# EAGLE design v001 (EAGLE 6.4)
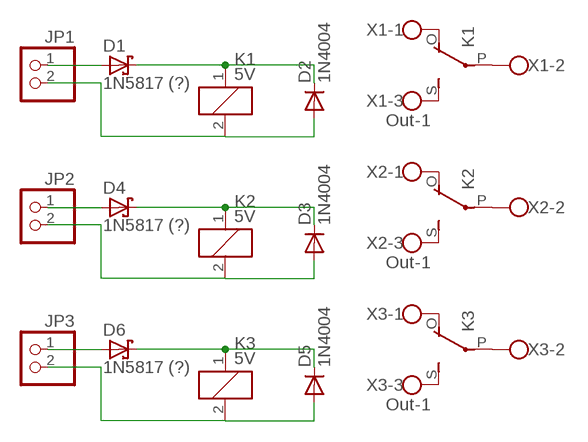
[diagram p0: schematic, sheet 1]

## Parts
D1  1N5817 (?)  1N5817-B  [DO41-7.6]
D2  1N4004  [DO41-10]
D3  1N4004  [DO41-10]
D4  1N5817 (?)  1N5817-B  [DO41-7.6]
D5  1N4004  [DO41-10]
D6  1N5817 (?)  1N5817-B  [DO41-7.6]
JP1  PINHD-1X2  [1X02]
JP2  PINHD-1X2  [1X02]
JP3  PINHD-1X2  [1X02]
K1  5V  G5L  [G5LE]
K2  5V  G5L  [G5LE]
K3  5V  G5L  [G5LE]
X1  Out-1  W237-103  [W237-103]
X2  Out-1  W237-103  [W237-103]
X3  Out-1  W237-103  [W237-103]

## Nets
N$1: K1.P(2:P) X1.2
N$2: K1.O(2:O) X1.1
N$3: K1.S(2:S) X1.3
N$4: D1.A JP1.1
N$5: D2.A JP1.2 K1.2
N$6: D1.C D2.C K1.1
N$7: K2.P(2:P) X2.2
N$8: K2.O(2:O) X2.1
N$9: K2.S(2:S) X2.3
N$10: D4.A JP2.1
N$11: D3.A JP2.2 K2.2
N$12: D3.C D4.C K2.1
N$13: K3.P(2:P) X3.2
N$14: K3.O(2:O) X3.1
N$15: K3.S(2:S) X3.3
N$16: D6.A JP3.1
N$17: D5.A JP3.2 K3.2
N$18: D5.C D6.C K3.1

## Library data of the parts
D1 D4 D6 = diode:1N581*: 1.0A SCHOTTKY BARRIER RECTIFIER Source: http://www.diodes.com/datasheets/ds23001.pdf
D2 D3 D5 = diode:1N4004: DIODE general purpose rectifier, 1 A
JP1-JP3 = pinhead:PINHD-1X2: PIN HEADER
K1-K3 = relay:G5L: RELAY 1 x switch, 10 A/120 V AC, 8 A/30 V ADC, Omron; OC_FARNELL: unknown; OC_NEWARK: unknown
X1-X3 = con-wago-500:W237-103: WAGO SCREW CLAMP; MPN: 237-103; OC_FARNELL: unknown; OC_NEWARK: 18M7116

## Board
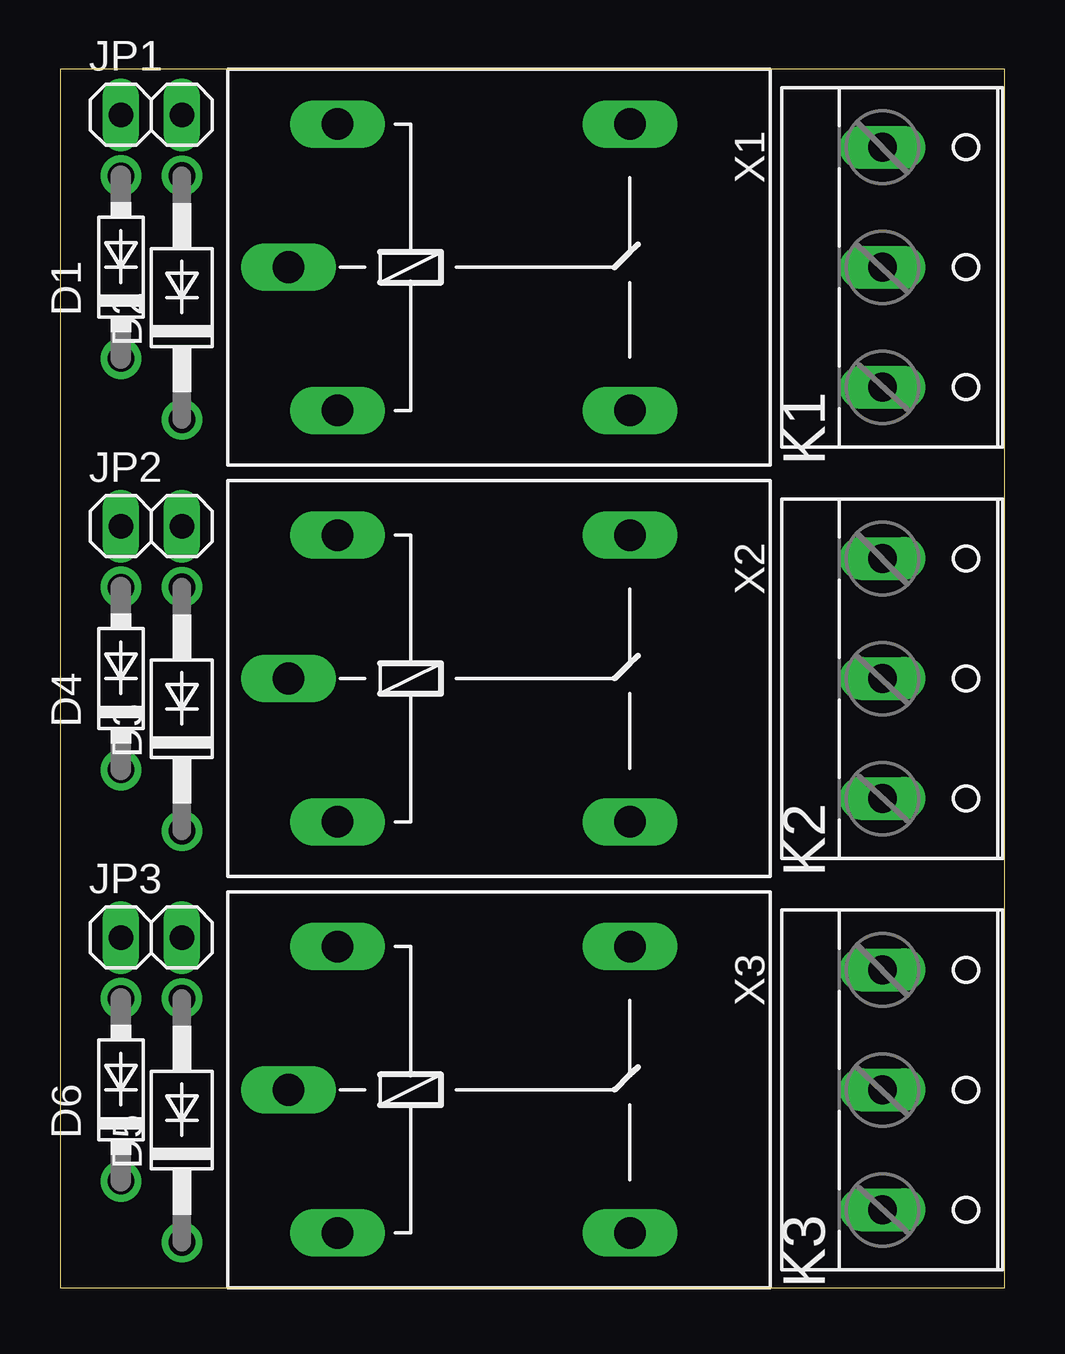
[diagram p1: board, top side]
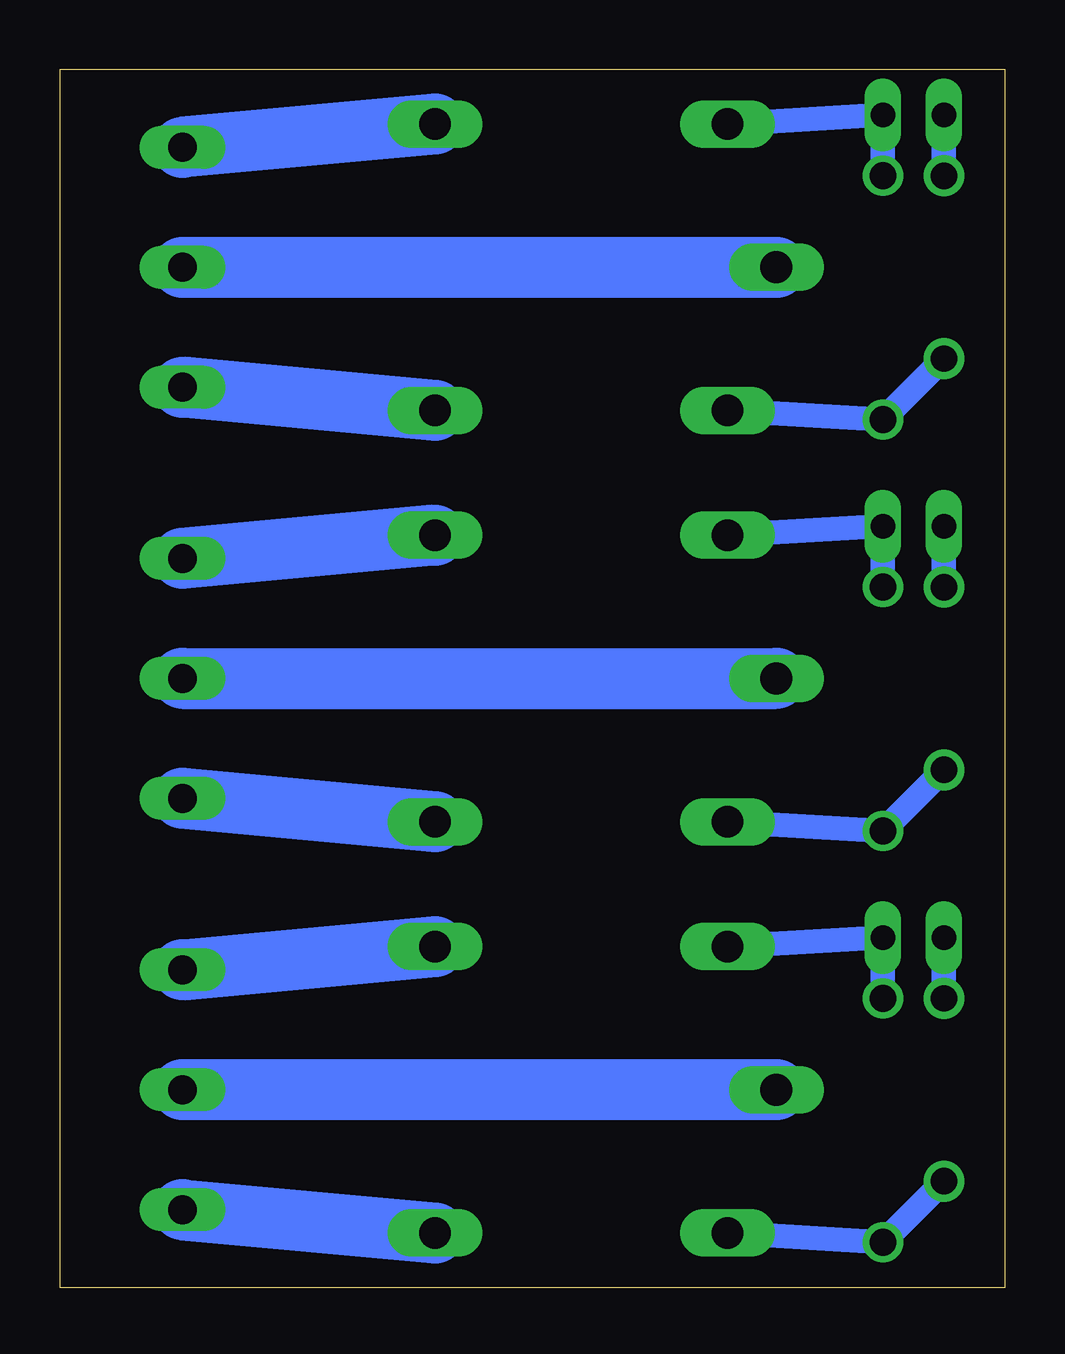
[diagram p2: board, bottom side, seen from below]

Size 39.37 x 50.8 mm. Coordinates in mm from the lower left corner, seen from the top.
Outline: 0,0 39.37,0 39.37,50.8 0,50.8 0,0
Copper layers (1*16): Top 0.035mm / dielectric 1.5mm / Bottom 0.035mm
Design rules "default": minimum track width 10mil, minimum drill 24mil, track to track 8mil, track to pad 8mil, pad to pad 8mil, via to via 8mil, smd to smd 8mil, copper to edge 40mil, drill to drill 8mil, minimum pad ring 10mil, minimum via ring 8mil, stop-mask expansion 4mil, vias tented up to drill 0mil, thermal gap 10mil

### Footprints (pad centres in the part's own frame; a part is rotated, then mirrored left to right if it is on the bottom)
DO41-7.6 = drill 1.1 pad 1.7: A 3.81,0; C -3.81,0
DO41-10 = drill 1.118: A 5.08,0; C -5.08,0
1X02 = drill 1.016 long: 1 -1.27,0; 2 1.27,0
G5LE = drill 1.321 long: 1 -7.493,-5.969; 2 -7.493,5.969; O 4.699,5.969; P -9.525,0; S 4.699,-5.969
W237-103 = drill 1.194 long: 1 -5,-1.29; 2 0,-1.29; 3 5,-1.29

### Placement (x,y rotation side)
D1  2.54,42.55 90 top
D2  5.08,41.27 90 top
D3  5.08,24.13 90 top
D4  2.54,25.4 90 top
D5  5.08,6.99 90 top
D6  2.54,8.26 90 top
JP1  3.81,48.9 0 top
JP2  3.81,31.75 0 top
JP3  3.81,14.61 0 top
K1  19.05,42.55 0 top
K2  19.05,25.4 0 top
K3  19.05,8.26 0 top
X1  35.56,42.55 270 top
X2  35.56,25.4 270 top
X3  35.56,8.26 270 top

### Tracks (layer width: path | path; a pad name or v marks a point on that pad's centre or on a via)
N$1
  Bottom 2.54: X1.2 K1.P
N$2
  Bottom 2.54: K1.O X1.1
N$3
  Bottom 2.54: K1.S X1.3
N$4
  Bottom 1.016: JP1.1 D1.A
N$5
  Bottom 1.016: K1.2 JP1.2 D2.A
N$6
  Bottom 1.016: D1.C D2.C K1.1
N$7
  Bottom 2.54: X2.2 K2.P
N$8
  Bottom 2.54: K2.O X2.1
N$9
  Bottom 2.54: K2.S X2.3
N$10
  Bottom 1.016: JP2.1 D4.A
N$11
  Bottom 1.016: K2.2 JP2.2 D3.A
N$12
  Bottom 1.016: D4.C D3.C K2.1
N$13
  Bottom 2.54: K3.P X3.2
N$14
  Bottom 2.54: X3.1 K3.O
N$15
  Bottom 2.54: X3.3 K3.S
N$16
  Bottom 1.016: JP3.1 D6.A
N$17
  Bottom 1.016: K3.2 JP3.2 D5.A
N$18
  Bottom 1.016: D6.C D5.C K3.1